# EAGLE design studio_sensor (EAGLE 6.4)
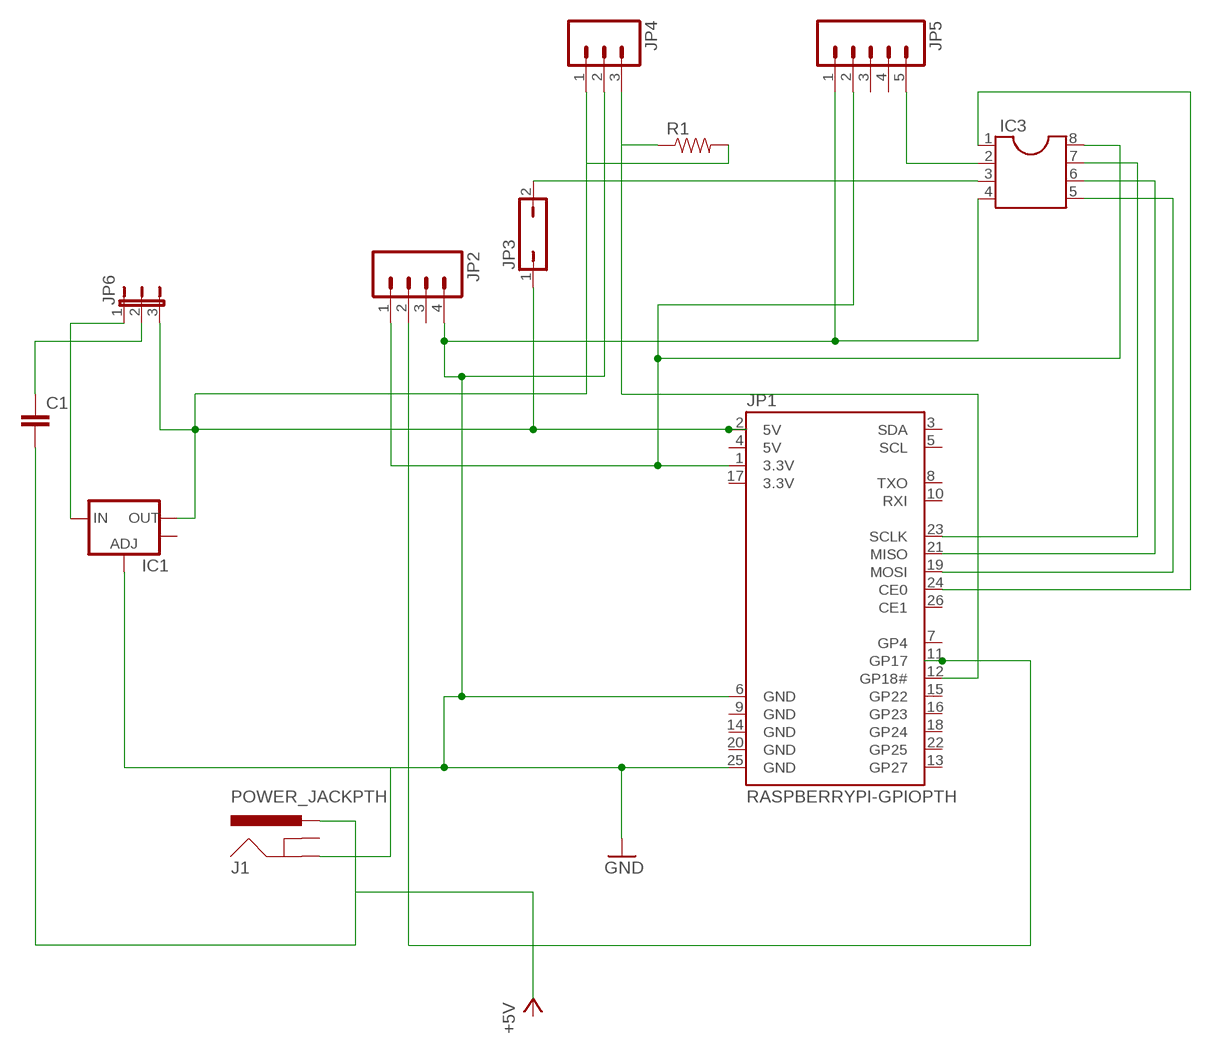
[diagram p0: schematic, sheet 1]

## Parts
C1  CAP0603-CAP  [0603-CAP]
IC1  V_REG_LM1117SOT223  [SOT223]
IC3  DIL8S  [SOCKET-08]
J1  POWER_JACKPTH  [POWER_JACK_PTH]
JP1  RASPBERRYPI-GPIOPTH  [2X13-SHROUDED]
JP2  M04PTH  [1X04]
JP3  JP1Q  [JP1]
JP4  M03PTH  [1X03]
JP5  M05PTH  [1X05]
JP6  JP2E  [JP2]
R1  4.7OHM1/10W5%(0603)  [0603]

## Nets
GND: IC1.1(ADJ) IC3.4 J1.GND JP1.6(GND) JP1.25(GND) JP2.4 JP4.2 JP5.1
N$1: IC1.2(OUT) JP1.2(5V) JP3.1 JP4.1 JP6.3 R1.2
N$2: IC3.8 JP1.1(3.3V) JP2.1 JP5.2
N$3: IC3.3 JP3.2
N$4: IC3.7 JP1.23(SCLK)
N$5: IC3.6 JP1.21(MISO)
N$6: IC3.5 JP1.19(MOSI)
N$7: IC3.1 JP1.24(CE0)
N$8: IC3.2 JP5.5
N$9: IC1.3(IN) JP6.1
N$10: JP1.11(GP17) JP2.2
N$11: C1.2 J1.PWR
N$12: C1.1 JP6.2
N$13: JP1.12(GP18#) JP4.3 R1.1
Unconnected: IC1.4(OUT) J1.GNDBREAK JP1.3(SDA) JP1.5(SCL) JP1.7(GP4) JP1.8(TXO) JP1.10(RXI) JP1.13(GP27) JP1.15(GP22) JP1.16(GP23) JP1.18(GP24) JP1.22(GP25) JP1.26(CE1) JP2.3 JP5.3 JP5.4

## Power pins joined to a net without a drawn wire
3.3V: JP1.17(3.3V)
5V: JP1.4(5V)
GND: JP1.9(GND) JP1.14(GND) JP1.20(GND)

## Library data of the parts
C1 = SparkFun-Capacitors:CAP: Capacitor Standard 0603 ceramic capacitor, and 0.1" leaded capacitor.
IC1 = SparkFun-PowerIC:V_REG_LM1117: Voltage Regulator LM1117 Standard adjustable voltage regulator but in SMD form. Spark Fun Electronics SKU : COM-00595
IC3 = ic-package:DIL8: Dual In Line / Socket
J1 = SparkFun-Connectors:POWER_JACK: Power Jack This is the standard 5.5mm barrel jack for power. The PTH is the most common, proven, reliable, footprint. The Slot footprint only works if the mill layer is transmitted to the PCB fab house so be warned. Mating wall wart : TOL-00298 (and others); PROD_ID: PRT-00119
JP1 = SparkFun-Boards:RASPBERRYPI-GPIO: RASPBERRY PI I/O HEADER As defined for the Revistion 2 Pi.; DIST: sparkfun; DIST_ID: PRT-11490
JP2 = SparkFun-Connectors:M04: Header 4 Standard 4-pin 0.1" header. Use with straight break away headers (SKU : PRT-00116), right angle break away headers (PRT-00553), swiss pins (PRT-00743), machine pins (PRT-00117), and female headers (PRT-00115). Molex polarized connector foot print use with SKU : PRT-08231 with associated crimp pins and housings. 1MM SMD Version SKU: PRT-10208
JP3 = jumper:JP1Q: JUMPER
JP4 = SparkFun-Connectors:M03: Header 3 Standard 3-pin 0.1" header. Use with straight break away headers (SKU : PRT-00116), right angle break away headers (PRT-00553), swiss pins (PRT-00743), machine pins (PRT-00117), and female headers (PRT-00115). Molex polarized connector foot print use with SKU : PRT-08232 with associated crimp pins and housings.
JP5 = SparkFun-Connectors:M05: Header 5 Standard 5-pin 0.1" header. Use with straight break away headers (SKU : PRT-00116), right angle break away headers (PRT-00553), swiss pins (PRT-00743), machine pins (PRT-00117), and female headers (PRT-00115). Molex polarized connector foot print use with SKU : PRT-08230 with associated crimp pins and housings.
JP6 = jumper:JP2E: JUMPER
R1 = SparkFun-Resistors:4.7OHM1/10W5%(0603): RES-08295; PROD_ID: RES-08295

## Board
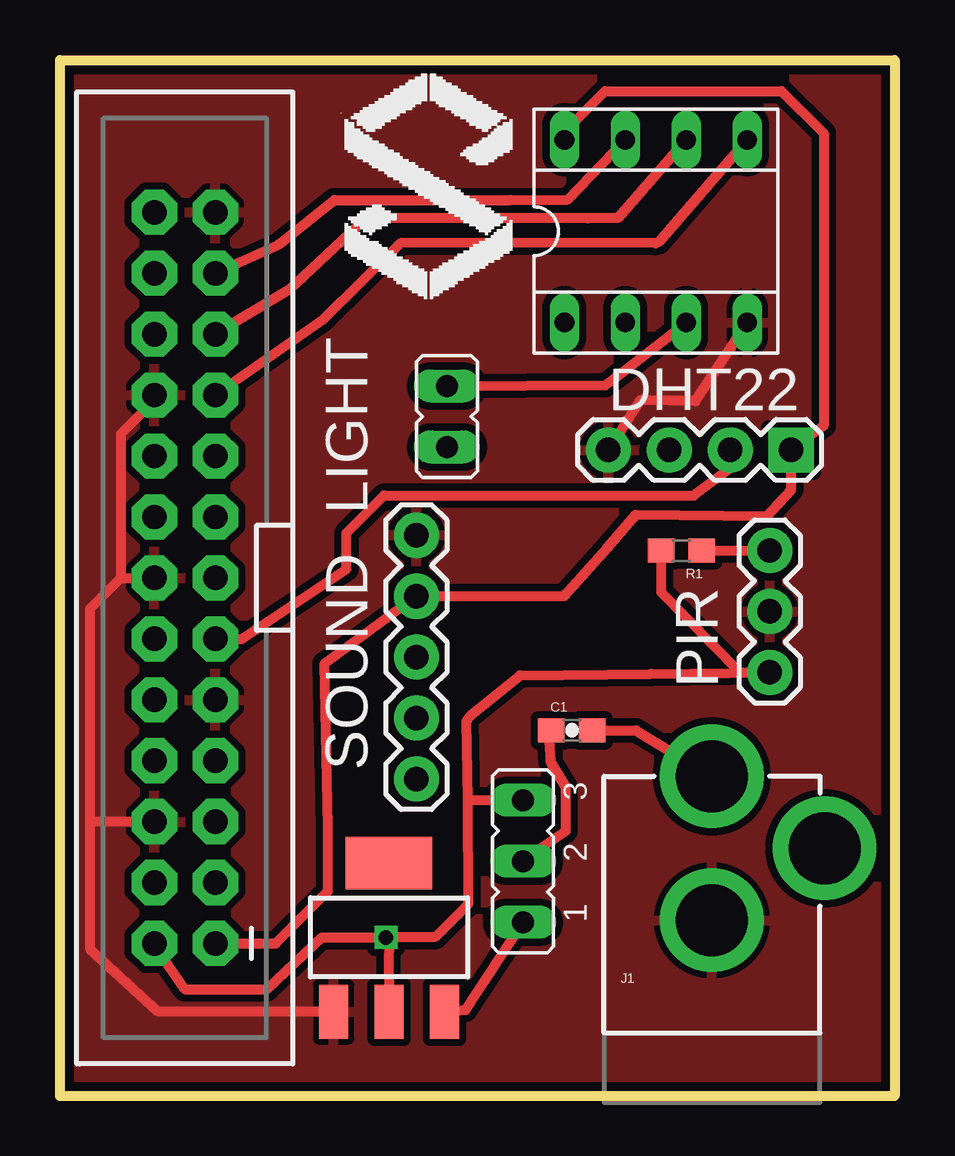
[diagram p1: board, top side]
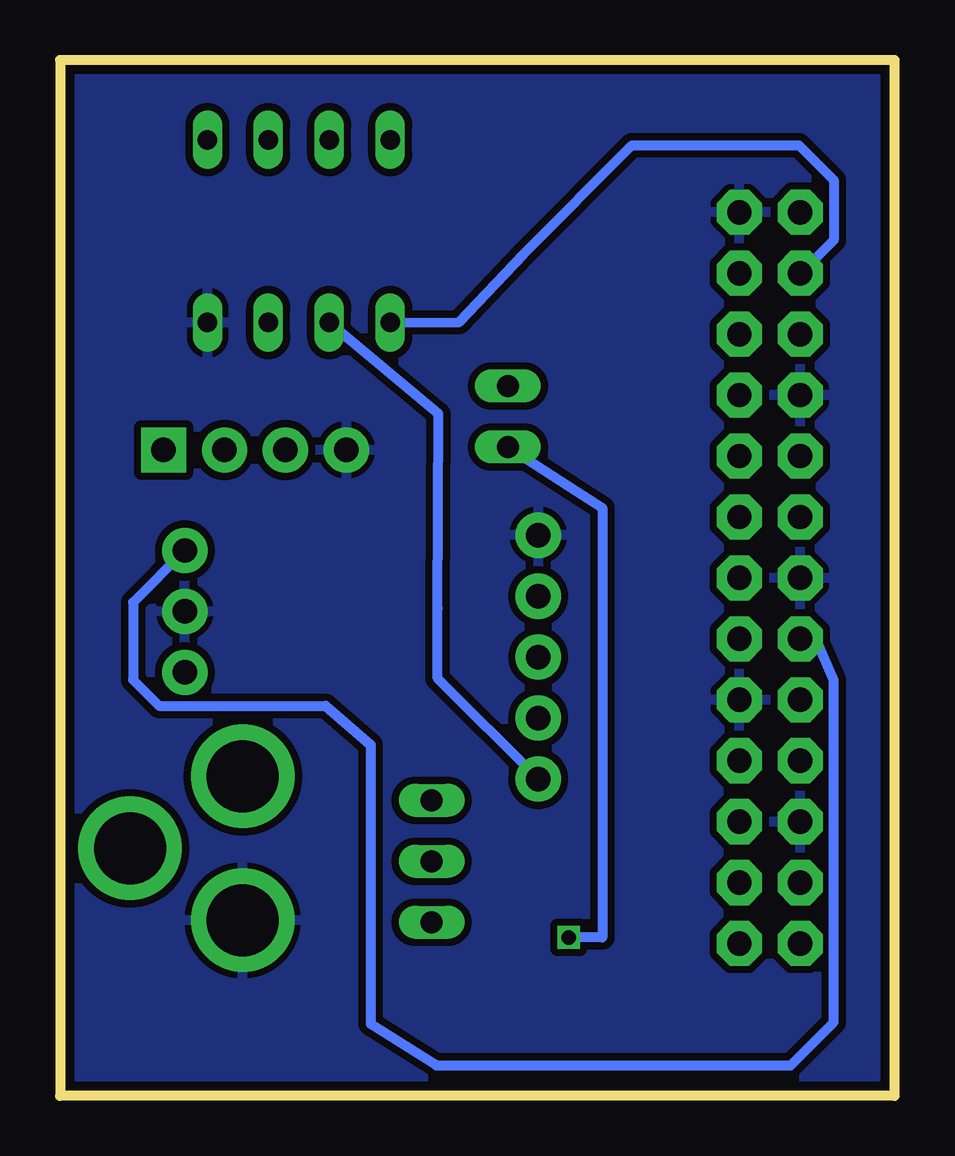
[diagram p2: board, bottom side, seen from below]

Size 34.8 x 43.18 mm. Coordinates in mm from the lower left corner, seen from the top.
Outline: 22.86,43.17 0,43.17
Outline: 0,43.17 0,0 34.8,0 34.8,43.18 0,43.18 0,43.17
Copper layers (1*16): Top 0.0356mm / dielectric 1.5011mm / Bottom 0.0356mm
Design rules "LaenPCBOrder": minimum track width 6mil, minimum drill 13mil, track to track 6mil, track to pad 6mil, pad to pad 6mil, via to via 6mil, smd to smd 6mil, copper to edge 15mil, drill to drill 6mil, minimum pad ring 7mil, minimum via ring 7mil, stop-mask expansion 3mil, vias tented up to drill 0mil, thermal gap 10mil

### Footprints (pad centres in the part's own frame; a part is rotated, then mirrored left to right if it is on the bottom)
0603-CAP = smd 1.1 x 1: 1 -0.85,0; 2 0.85,0
SOT223 = smd 1.219 x 2.235: 1 -2.311,-3.099; 2 0,-3.099; 3 2.311,-3.099 | smd 3.6 x 2.2: 4 0,3.099
SOCKET-08 = drill 0.813 long: 1 -3.81,-3.81; 2 -1.27,-3.81; 3 1.27,-3.81; 4 3.81,-3.81; 5 3.81,3.81; 6 1.27,3.81; 7 -1.27,3.81; 8 -3.81,3.81
POWER_JACK_PTH = drill 2.997 pad 4.318: GND 0,7.7; GNDBREAK 4.7,10.7; PWR 0,13.7
2X13-SHROUDED = drill 1.016 pad 1.88 octagon: 1 -1.27,15.24; 2 1.27,15.24; 3 -1.27,12.7; 4 1.27,12.7; 5 -1.27,10.16; 6 1.27,10.16; 7 -1.27,7.62; 8 1.27,7.62; 9 -1.27,5.08; 10 1.27,5.08; 11 -1.27,2.54; 12 1.27,2.54; 13 -1.27,0; 14 1.27,0; 15 -1.27,-2.54; 16 1.27,-2.54; 17 -1.27,-5.08; 18 1.27,-5.08; 19 -1.27,-7.62; 20 1.27,-7.62; 21 -1.27,-10.16; 22 1.27,-10.16; 23 -1.27,-12.7; 24 1.27,-12.7; 25 -1.27,-15.24; 26 1.27,-15.24
1X04 = drill 1.016 pad 1.88 square: 1 0,0 | drill 1.016 pad 1.88: 2 2.54,0; 3 5.08,0; 4 7.62,0
JP1 = drill 0.914 long: 1 0,-1.27; 2 0,1.27
1X03 = drill 1.016 pad 1.88: 1 0,0; 2 2.54,0; 3 5.08,0
1X05 = drill 1.016 pad 1.88: 1 0,0; 2 2.54,0; 3 5.08,0; 4 7.62,0; 5 10.16,0
JP2 = drill 0.914 long: 1 -2.54,0; 2 0,0; 3 2.54,0
0603 = smd 1.1 x 1: 1 -0.85,0; 2 0.85,0

### Placement (x,y rotation side)
C1  21.34,15.24 0 top
IC1  13.72,6.6 0 top
IC3  24.84,36.04 0 top
J1  27.18,-0.38 0 top
JP1  5.21,21.59 180 top
JP2  30.48,26.92 180 top
JP3  16.13,28.32 0 top
JP4  29.59,17.65 90 top
JP5  14.86,23.37 270 top
JP6  19.3,9.78 90 top
R1  25.91,22.73 180 top

### Tracks (layer width: path | path; a pad name or v marks a point on that pad's centre or on a via)
GND
  Top 0.406: JP1.20 4.16,29.21 2.54,27.59 2.54,21.59 | 2.54,21.59 JP1.14 | JP1.6 1.27,11.43 | 1.27,11.43 1.27,20.32 2.54,21.59 | IC3.4 26.49,28.96 24.21,29.01 JP2.4 | IC1.1 5.3,3.5 4.1,3.51 1.27,6.1 1.27,11.43
  pour Top (isolate 0.305): 0,43.18 34.8,43.31 34.8,-0.13 0,-0.25
  pour Bottom (isolate 0.305): 0,43.18 34.8,43.18 34.8,0 0,0
N$1  (via drill 0.6)
  Top 0.406: 17,12.31 17.03,8 15.63,6.62 v13.59,6.6 | 17,12.31 16.96,15.62 17.14,15.88 19.18,17.53 24.64,17.59 JP4.1 28.32,17.68 25.06,21 R1.2 | JP1.2 4.32,5.71 5.21,4.45 8.64,4.45 10.92,6.6 v13.59,6.6 | v13.59,6.6 13.72,6.6 13.7,5.33 13.72,4.33 IC1.2 | JP6.3 19.42,12.32 17,12.31
  Bottom 0.406: JP3.1 13.59,25.4 12.19,24.51 12.19,6.6 v13.59,6.6
N$2
  Top 0.406: IC3.8 21.03,40.2 22.72,41.89 30.08,41.89 31.84,40.12 31.84,27.94 JP2.1 30.48,25.27 29.46,24.17 24,24.23 22.84,22.89 21.01,20.83 JP5.2 11.04,18.03 11.18,11.18 11.18,8.54 8.99,6.35 JP1.1
N$3
  Top 0.406: JP3.2 22.73,29.62 22.83,29.7 22.96,29.79 IC3.3
N$4
  Top 0.406: JP1.23 9.11,35.48 11.43,37.35 11.43,37.34 18.77,37.34 21.18,37.36 IC3.7
N$5
  Top 0.406: JP1.21 9.53,33.59 12.7,36.54 12.7,36.58 22.01,36.58 23.27,36.59 IC3.6
N$6
  Top 0.406: IC3.5 24.97,35.6 24.83,35.54 14.22,35.56 14.22,35.55 10.98,32.36 JP1.19
N$7
  Bottom 0.406: IC3.1 18.16,32.24 15.48,35.08 10.95,39.62 3.99,39.62 2.54,38.18 2.54,35.66 3.91,34.29 JP1.24
N$8
  Bottom 0.406: JP5.5 19.05,17.4 19.05,20.32 19.02,28.42 IC3.2
N$9
  Top 0.406: IC1.3 16.92,3.58 JP6.1
N$10
  Top 0.406: JP1.11 7.6,19.05 7.62,19.07 11.94,21.97 11.94,23.46 13.5,25.03 26.42,25.02 27.94,26.16 JP2.2
N$11
  Top 0.406: J1.PWR 24.02,15.24 C1.2
N$12
  Top 0.406: C1.1 20.36,15.07 20.45,13.97 20.5,13.84 21.08,12.88 21.08,11.03 19.83,10.16 19.68,10.16 JP6.2
N$13
  Top 0.406: R1.1 JP4.3
  Bottom 0.406: JP1.12 3.23,18.92 2.54,17.34 2.54,3.07 4.34,1.27 19.1,1.27 21.84,3 21.84,14.63 23.72,16.26 30.66,16.26 31.75,17.34 31.75,20.57 JP4.3

### Text on the board
tPlace: DHT22 | PIR | SOUND
tNames: LIGHT